# EAGLE design eRIC_BEE (EAGLE 7.2.0)
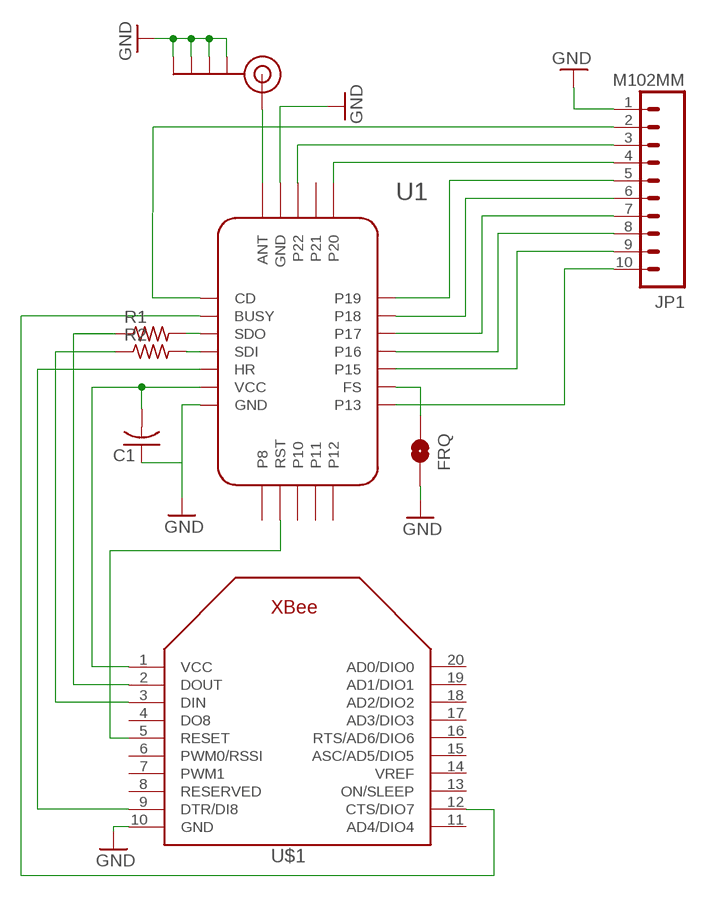
[diagram p0: schematic, sheet 1]

## Parts
C1  C-USC0402  [C0402]
FRQ  JUMPER-PAD-2-NOYES_SILK  [PAD-JUMPER-2-NO_YES_SILK]
J$2  SMA_EDGE  [SMA-EDGE]
JP1  M102MM  [1X10-2MM]
R1  R-US_R0402  [R0402]
R2  R-US_R0402  [R0402]
U1  ERIC  [ERIC]
U$1  XBEE  [XBEE]

## Nets
GND: C1.1 FRQ.2 J$2.GND@0(GND) J$2.GND@1(GND) J$2.GND@2(GND) J$2.GND@3(GND) JP1.1 U1.AGND(GND) U1.GND U$1.10(GND)
N$1: FRQ.1 U1.FS
N$2: R1.1 U$1.2(DOUT)
N$3: R2.1 U$1.3(DIN)
N$4: J$2.SIG(SIGNAL) U1.ANT
N$5: U1.HR U$1.9(DTR/DI8)
N$6: R2.2 U1.SDI
N$7: U1.BUSY U$1.12(CTS/DIO7)
N$8: R1.2 U1.SDO
N$9: JP1.4 U1.E20(P20)
N$10: JP1.2 U1.CD
N$11: JP1.3 U1.E22(P22)
N$12: JP1.5 U1.E19(P19)
N$13: JP1.6 U1.E18(P18)
N$14: JP1.7 U1.E17(P17)
N$15: JP1.8 U1.E16(P16)
N$16: JP1.9 U1.E15(P15)
N$17: JP1.10 U1.E13(P13)
N$18: U1.E9(RST) U$1.5(RESET)
VCC: C1.2 U1.VCC U$1.1(VCC)
Unconnected: U1.E8(P8) U1.E10(P10) U1.E11(P11) U1.E12(P12) U1.E21(P21) U$1.4(DO8) U$1.6(PWM0/RSSI) U$1.7(PWM1) U$1.8(RESERVED) U$1.11(AD4/DIO4) U$1.13(ON/SLEEP) U$1.14(VREF) U$1.15(ASC/AD5/DIO5) U$1.16(RTS/AD6/DIO6) U$1.17(AD3/DIO3) U$1.18(AD2/DIO2) U$1.19(AD1/DIO1) U$1.20(AD0/DIO0)

## Library data of the parts
C1 = adafruit:C-US: CAPACITOR, American symbol
FRQ = SparkFun-Passives:JUMPER-PAD-2-NO
J$2 = SparkFun-Connectors:SMA_EDGE: SMA Antenna Connector End launch SMA connector. The paste layer has been removed so that the connector can be hand soldered onto the board after reflow.
JP1 = SparkFun-Connectors:M10: Header 10 Standard 10-pin 0.1" header. Use with straight break away headers (SKU : PRT-00116), right angle break away headers (PRT-00553), swiss pins (PRT-00743), machine pins (PRT-00117), and female headers (PRT-00115).
R1 R2 = adafruit:R-US_: RESISTOR, American symbol
U1 = lprs:ERIC: eRIC SoC Radio Transceiver VCC: -0.3 to +6.0V I/O: -0.3 to +3.3V Operating Temperature: -40°C to 85°C Antenna: 50V p-p @ < 10MHz by Low Power Radio Solutions ( http://www.lprs.co.uk )
U$1 = adafruit:XBEE

## Board
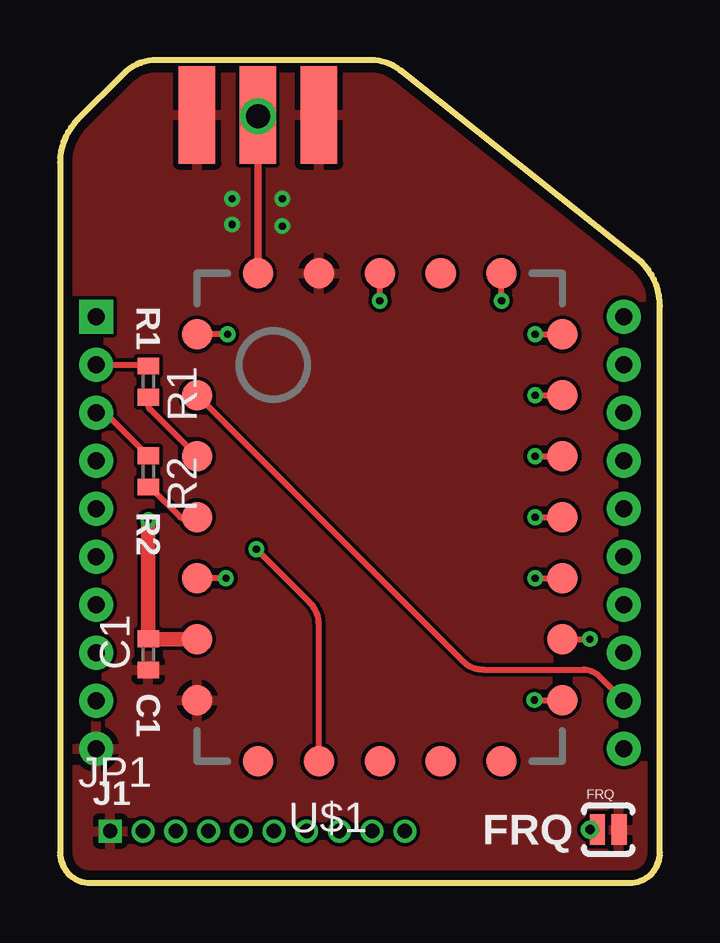
[diagram p1: board, top side]
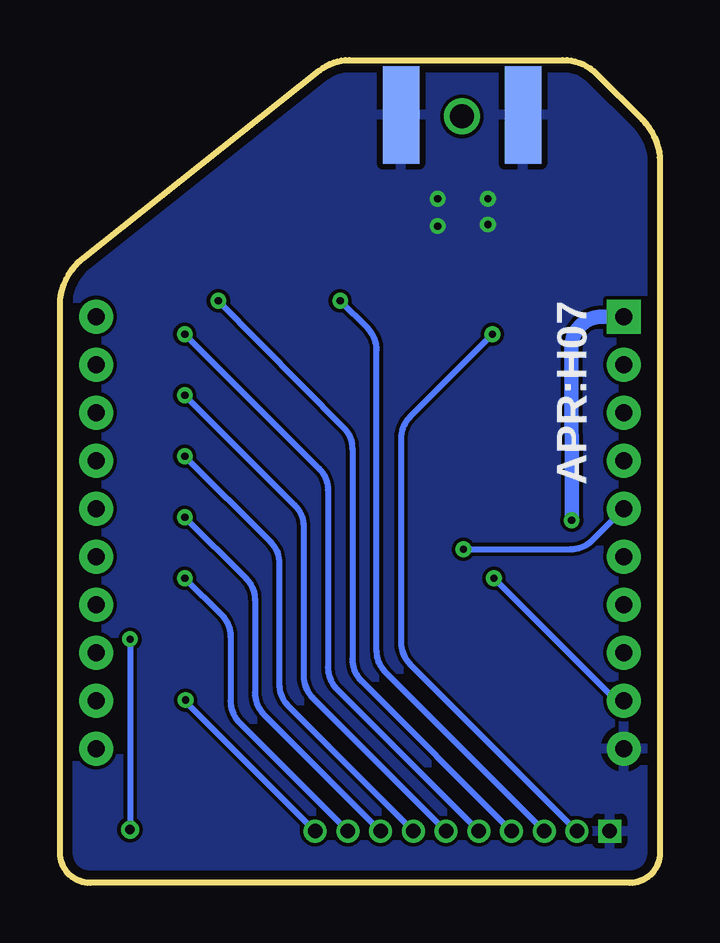
[diagram p2: board, bottom side, seen from below]

Size 25.02 x 34.29 mm. Coordinates in mm from the lower left corner, seen from the top.
Outline: 0,30.02 0,1.27 arc90 1.27,0 23.75,0 arc90 25.02,1.27 25.02,24.04 arc52 24.06,26.03 14.19,33.86 arc38 12.95,34.29 4.05,34.29 arc45 2.64,33.7 0.74,31.81 arc45 0,30.02
Copper layers (1*16): Top 0.0356mm / dielectric 1.5011mm / Bottom 0.0356mm
Design rules "eRIC_breakout *": minimum track width 6mil, minimum drill 13mil, track to track 6mil, track to pad 6mil, pad to pad 6mil, via to via 6mil, smd to smd 6mil, copper to edge 15mil, drill to drill 6mil, minimum pad ring 7mil, minimum via ring 7mil, stop-mask expansion 3mil, vias tented up to drill 0.3mm, thermal gap 10mil

### Footprints (pad centres in the part's own frame; a part is rotated, then mirrored left to right if it is on the bottom)
C0402 = smd 0.7 x 0.9: 1 -0.65,0; 2 0.65,0
PAD-JUMPER-2-NO_YES_SILK = smd 0.635 x 1.27: 1 -0.45,0; 2 0.45,0
SMA-EDGE = smd 1.524 x 4.064: GND@0 0,0; GND@1 5.08,0; SIG 2.54,0 | smd 1.524 x 4.064 bottom: GND@2 0,0; GND@3 5.08,0
1X10-2MM = drill 0.6 square: 1 0,0 | drill 0.6: 2 1.365,0; 3 2.73,0; 4 4.095,0; 5 5.46,0; 6 6.825,0; 7 8.19,0; 8 9.555,0; 9 10.92,0; 10 12.285,0
R0402 = smd 0.7 x 0.9: 1 -0.65,0; 2 0.65,0
ERIC = smd 1.27 x 1.27: AGND 5.08,20.32; ANT 2.54,20.32; BUSY 0,15.24; CD 0,17.78; E8 2.54,0; E9 5.08,0; E10 7.62,0; E11 10.16,0; E12 12.7,0; E13 15.24,2.54; E15 15.24,7.62; E16 15.24,10.16; E17 15.24,12.7; E18 15.24,15.24; E19 15.24,17.78; E20 12.7,20.32; E21 10.16,20.32; E22 7.62,20.32; FS 15.24,5.08; GND 0,2.54; HR 0,7.62; SDI 0,10.16; SDO 0,12.7; VCC 0,5.08
XBEE = drill 0.7 pad 1.422 square: 1 -11,5.5 | drill 0.7 pad 1.422: 2 -11,3.5; 3 -11,1.5; 4 -11,-0.5; 5 -11,-2.5; 6 -11,-4.5; 7 -11,-6.5; 8 -11,-8.5; 9 -11,-10.5; 10 -11,-12.5; 11 11,-12.5; 12 11,-10.5; 13 11,-8.5; 14 11,-6.5; 15 11,-4.5; 16 11,-2.5; 17 11,-0.5; 18 11,1.5; 19 11,3.5; 20 11,5.5

### Placement (x,y rotation side)
C1  3.68,9.53 90 top
FRQ  22.86,2.22 0 top
J$2  5.72,32 0 top
JP1  2.1,2.16 0 top
R1  3.68,20.89 270 top
R2  3.68,17.14 270 top
U1  5.72,5.08 0 top
U$1  12.51,18.1 0 top

### Tracks (layer width: path | path; a pad name or v marks a point on that pad's centre or on a via)
GND  (via drill 0.3)
  other vias: 7.18,28.51 7.18,27.43 9.27,28.51 9.27,27.37
  pour Top: 24.96,26.03 25.02,1.27 arc-90 23.75,0 1.33,0 arc-90 0.06,1.27 0.06,31.69 2.6,34.23 14.53,34.23
  pour Bottom: 0,31.69 0,1.27 arc90 1.27,0 23.75,0 arc90 25.02,1.27 24.96,25.96 14.47,34.29 2.54,34.23
N$1  (via drill 0.3, 0.4)
  Top 0.254: U1.FS v22.1,10.16 | v22.1,2.22 FRQ.1
  Bottom 0.254: v22.1,10.16 v22.1,2.22
N$2
  Top 0.254: U$1.2 3.63,21.6 R1.1
N$3
  Top 0.254: U$1.3 1.88,19.6 R2.1
N$4
  Top 0.305: U1.ANT J$2.SIG
N$5  (via drill 0.3)
  Top 0.254: v6.92,12.7 U1.HR
  Bottom 0.254: U$1.9 1.82,7.6 v6.92,12.7
N$6
  Top 0.254: R2.2 3.76,16.49 5.01,15.25 arc45 5.18,15.18 5.65,15.18 U1.SDI
N$7
  Top 0.254: U1.BUSY 16.77,9.26 arc45 17.67,8.89 21.8,8.89 arc-45 22.51,8.6 U$1.12
N$8
  Top 0.254: R1.2 3.68,19.92 arc45 3.76,19.74 U1.SDO
N$9  (via drill 0.3)
  Top 0.254: v18.41,24.26 U1.E20
  Bottom 0.254: v18.41,24.26 13.2,18.98 arc45 12.83,18.08 12.83,9.32 arc-45 12.46,8.42 JP1.4
N$10  (via drill 0.3)
  Top 0.254: v6.99,22.86 U1.CD
  Bottom 0.254: JP1.2 10.42,9.12 arc45 10.8,10.02 10.8,18.52 arc45 10.42,19.42 v6.99,22.86
N$11  (via drill 0.3)
  Top 0.254: v13.34,24.26 U1.E22
  Bottom 0.254: JP1.3 11.44,8.77 arc45 11.81,9.67 11.81,22.21 arc-45 12.18,23.11 v13.34,24.26
N$12  (via drill 0.3)
  Top 0.254: v19.81,22.86 U1.E19
  Bottom 0.254: v19.81,22.86 14.21,17.26 arc45 13.84,16.36 13.84,8.97 arc-45 13.47,8.08 JP1.5
N$13  (via drill 0.3)
  Top 0.254: v19.81,20.32 U1.E18
  Bottom 0.254: v19.81,20.32 15.23,15.74 arc45 14.86,14.84 14.86,8.62 arc-45 14.49,7.73 JP1.6
N$14  (via drill 0.3)
  Top 0.254: v19.81,17.78 U1.E17
  Bottom 0.254: v19.81,17.78 16.25,14.21 arc45 15.88,13.32 15.88,8.28 arc-45 15.5,7.38 JP1.7
N$15  (via drill 0.3)
  Top 0.254: v19.81,15.24 U1.E16
  Bottom 0.254: v19.81,15.24 17.26,12.69 arc45 16.89,11.79 16.89,7.93 arc-45 16.52,7.03 JP1.8
N$16  (via drill 0.3)
  Top 0.254: v19.81,12.7 U1.E15
  Bottom 0.254: v19.81,12.7 18.28,11.17 arc45 17.91,10.27 17.91,7.58 arc-45 17.54,6.68 JP1.9
N$17  (via drill 0.3)
  Top 0.254: v19.78,7.62 U1.E13
  Bottom 0.254: JP1.10 19.73,7.51 arc45 v19.78,7.62
N$18  (via drill 0.3)
  Top 0.254: U1.E9 10.8,10.78 arc45 10.42,11.68 v8.19,13.91
  Bottom 0.254: v8.19,13.91 3.73,13.91 arc-45 2.83,14.28 U$1.5
N$20  (via drill 1)
  other vias: 8.25,31.94
VCC  (via drill 0.3)
  Top 0.305: 3.83,10.16 arc-90 C1.2
  Top 0.61: v3.68,15.11 C1.2 | U1.VCC 3.83,10.16
  Bottom 0.61: U$1.1 2.42,23.6 arc-90 3.69,22.32 v3.68,15.11

### Text on the board
_tsilk: R1 | R2 | C1 | J1 | FRQ
_bsilk: APR:H07